# EAGLE design SCHW (EAGLE 9.2.0)

## Sheet 1 of 2
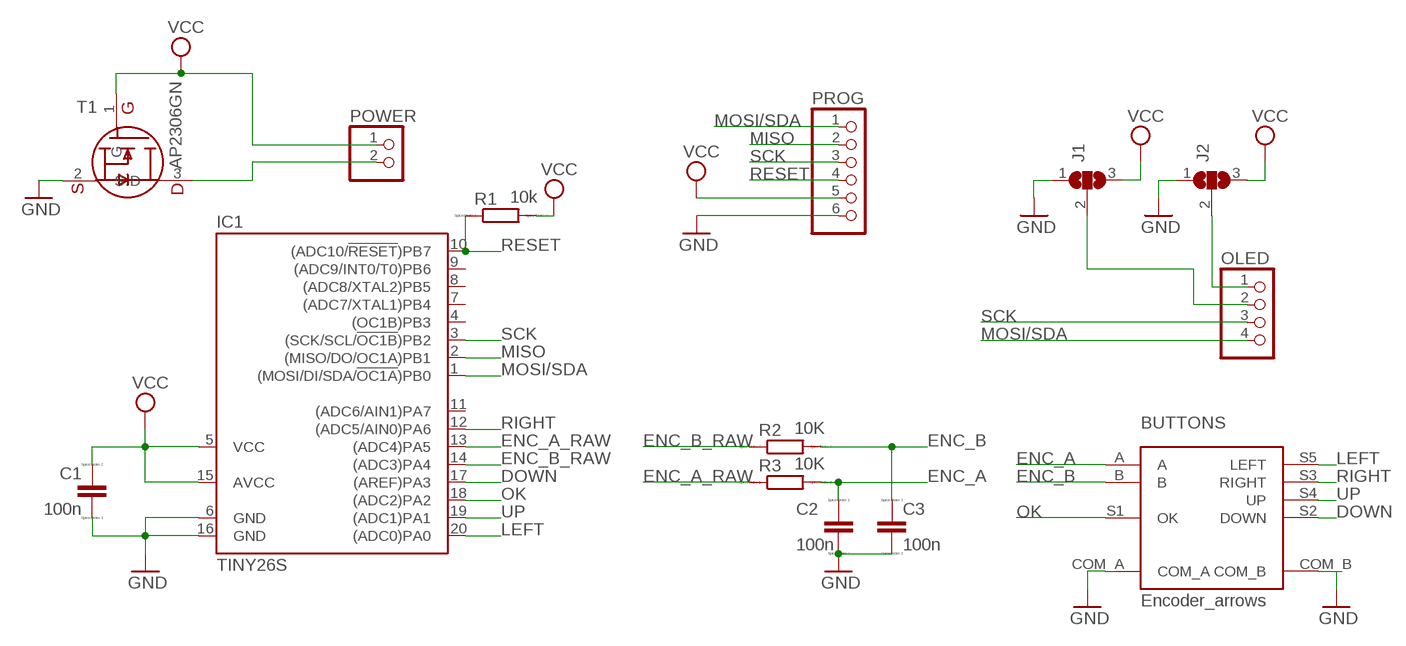
[diagram p0: schematic, sheet 1]

### Parts
BUTTONS  ENCODER_ARROWS  [ENCODER_ARROWS]
C1  100n  C  [C0805]
C2  100n  C  [C0805]
C3  100n  C  [C0805]
IC1  TINY26S  [SO20L]
J1  SJ2W  [SJ_2]
J2  SJ2W  [SJ_2]
OLED  PINHD-1X4  [1X04]
POWER  PINHD-1X2  [1X02]
PROG  PINHD-1X6  [1X06]
R1  10k  R  [R0805]
R2  10K  R  [R0805]
R3  10K  R  [R0805]
T1  AP2306GN_MOSFETSOT23  [SOT23]

### Nets
DOWN: BUTTONS.S2(DOWN) IC1.17((AREF)PA3)
ENC_A: BUTTONS.A C2.1 R3.2
ENC_A_RAW: IC1.13((ADC4)PA5) R3.1
ENC_B: BUTTONS.B C3.1 R2.2
ENC_B_RAW: IC1.14((ADC3)PA4) R2.1
GND: BUTTONS.COM_A BUTTONS.COM_B C1.1 C2.2 C3.2 IC1.6(GND) IC1.16(GND) J1.1 J2.1 PROG.6 T1.2(S)
LEFT: BUTTONS.S5(LEFT) IC1.20((ADC0)PA0)
MISO: IC1.2((MISO/DO/OC1A)PB1) PROG.2
MOSI/SDA: IC1.1((MOSI/DI/SDA/!OC1A!)PB0) OLED.4 PROG.1
N$2: POWER.2 T1.3(D)
N$3: J2.2 OLED.1
N$4: J1.2 OLED.2
OK: BUTTONS.S1(OK) IC1.18((ADC2)PA2)
RESET: IC1.10((ADC10/!RESET!)PB7) PROG.4 R1.1
RIGHT: BUTTONS.S3(RIGHT) IC1.12((ADC5/AIN0)PA6)
SCK: IC1.3((SCK/SCL/!OC1B!)PB2) OLED.3 PROG.3
UP: BUTTONS.S4(UP) IC1.19((ADC1)PA1)
VCC: C1.2 IC1.5(VCC) IC1.15(AVCC) J1.3 J2.3 POWER.1 PROG.5 R1.2 T1.1(G)
Unconnected: IC1.4((OC1B)PB3) IC1.7((ADC7/XTAL1)PB4) IC1.8((ADC8/XTAL2)PB5) IC1.9((ADC9/INT0/T0)PB6) IC1.11((ADC6/AIN1)PA7)

## Sheet 2 of 2

## Library data of the parts
BUTTONS = dt:ENCODER_ARROWS: Rottary encoder with center button and four arrows.
C1-C3 = eagle-ltspice:C: CAPACITOR, European symbol; SPICEMODEL: NONE; SPICEPREFIX: C
IC1 = atmel:TINY26*: 8-bit AVR Microcontroller with 2K Bytes Flash Source: http://www.atmel.com .. doc1477.pdf; MPN: ATTINY261-20SU; OC_FARNELL: 1455147; OC_NEWARK: 58M3783
J1 J2 = jumper:SJ2W: SMD solder JUMPER
OLED = pinhead:PINHD-1X4: PIN HEADER
POWER = pinhead:PINHD-1X2: PIN HEADER
PROG = pinhead:PINHD-1X6: PIN HEADER
R1-R3 = eagle-ltspice:R: RESISTOR, European symbol; SPICEMODEL: NONE; SPICEPREFIX: R
T1 = dt:AP2306GN_MOSFET: AP2306GN_MOSFETSOT23

## Board
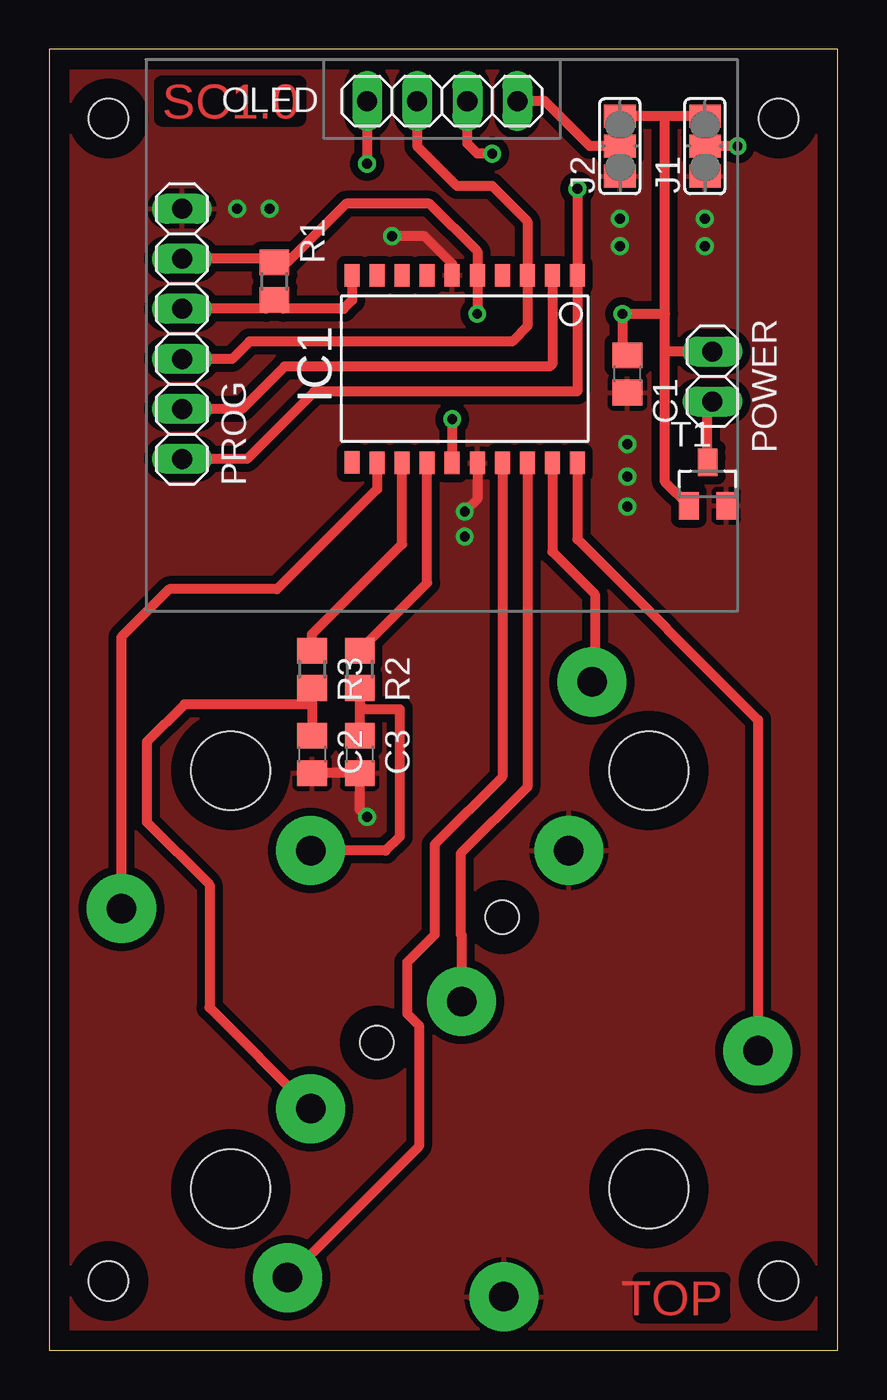
[diagram p1: board, top side]
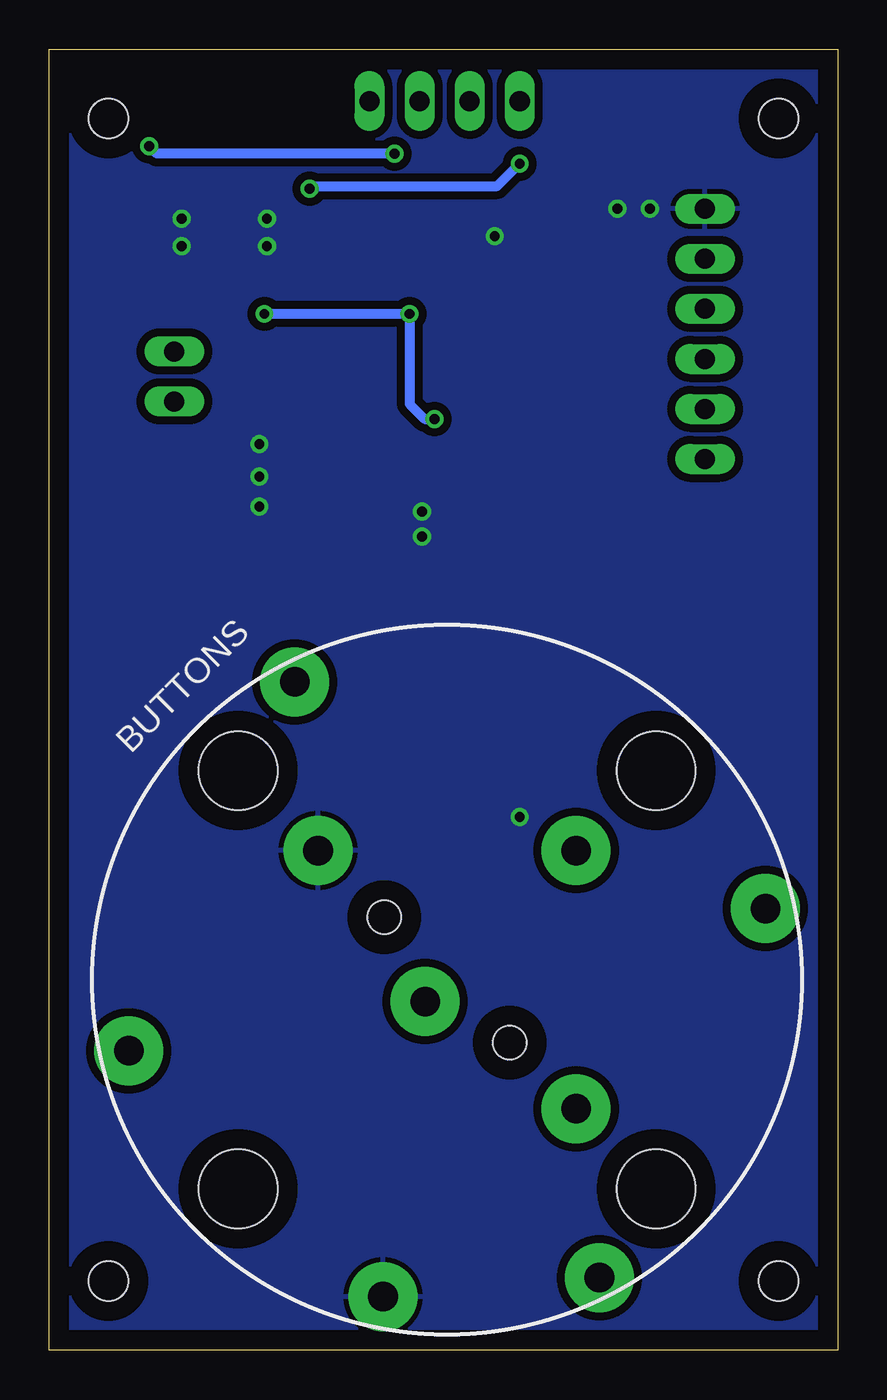
[diagram p2: board, bottom side, seen from below]

Size 40 x 66 mm. Coordinates in mm from the lower left corner, seen from the top.
Outline: 0,0 40,0 40,66 0,66 0,0
Copper layers (1*16): Top 0.035mm / dielectric 1.5mm / Bottom 0.035mm
Design rules "default": minimum track width 6mil, minimum drill 0.35mm, track to track 6mil, track to pad 6mil, pad to pad 6mil, via to via 6mil, smd to smd 6mil, copper to edge 40mil, drill to drill 6mil, minimum pad ring 10mil, minimum via ring 8mil, stop-mask expansion 4mil, vias tented up to drill 0mil, thermal gap 10mil
Holes 2 mm at 37,3.5 3,3.5 3,62.5 37,62.5

### Footprints (pad centres in the part's own frame; a part is rotated, then mirrored left to right if it is on the bottom)
ENCODER_ARROWS = drill 1.5 pad 3.5: A 0,-9.26; B 9.26,0; COM_A 0,9.26; COM_B -13.67,-9.07; S1 -1.57,0; S2 -5.22,-16.15; S3 13.97,-8.87; S4 5.22,16.15; S5 -13.97,8.87 | hole 4: 0,-15; 0,15; -15,0; 15,0 | hole 1.7: 0,4.5; 0,-4.5
C0805 = smd 1.3 x 1.5: 1 -0.95,0; 2 0.95,0
SO20L = smd 0.762 x 1.143: 1 -5.08,-5.131; 2 -3.81,-5.131; 3 -2.54,-5.131; 4 -1.27,-5.131; 5 0,-5.131; 6 1.27,-5.131; 7 2.54,-5.131; 8 3.81,-5.131; 9 5.08,-5.131; 10 6.35,-5.131; 11 6.35,4.369; 12 5.08,4.394; 13 3.81,4.394; 14 2.54,4.394; 15 1.27,4.394; 16 0,4.394; 17 -1.27,4.394; 18 -2.54,4.394; 19 -3.81,4.394; 20 -5.08,4.394
SJ_2 = smd 1.168 x 1.6: 1 -1.524,0; 2 0,0; 3 1.524,0
1X04 = drill 1.016 long: 1 -3.81,0; 2 -1.27,0; 3 1.27,0; 4 3.81,0
1X02 = drill 1.016 long: 1 -1.27,0; 2 1.27,0
1X06 = drill 1.016 long: 1 -6.35,0; 2 -3.81,0; 3 -1.27,0; 4 1.27,0; 5 3.81,0; 6 6.35,0
R0805 = smd 1.3 x 1.5: 1 -0.95,0; 2 0.95,0
SOT23 = smd 1 x 1.4: 1 -0.95,-1.1; 2 0.95,-1.1; 3 0,1.1

### Placement (x,y rotation side)
BUTTONS  19.81,18.8 45 bottom
C1  29.34,49.53 90 top
C2  13.34,30.23 270 top
C3  15.75,30.23 270 top
IC1  21.72,49.4 180 top
J1  33.27,61.09 90 top
J2  28.96,61.09 90 top
OLED  19.94,63.37 180 top
POWER  33.66,49.4 270 top
PROG  6.73,51.56 90 top
R1  11.43,54.23 90 top
R2  15.75,34.54 270 top
R3  13.34,34.54 270 top
T1  33.4,43.94 0 top

### Tracks (layer width: path | path; a pad name or v marks a point on that pad's centre or on a via)
DOWN
  Top 0.508: BUTTONS.S2 18.75,10.35 18.75,16.49 18.16,17.08 18.16,19.68 19.56,21.08 19.56,25.65 22.99,29.08 IC1.17
ENC_A
  Top 0.508: R3.2 13.34,32.77 | 13.34,32.77 C2.1 | BUTTONS.A 8.13,17.38 8.13,23.62 4.95,26.8 4.95,30.86 6.86,32.77 13.34,32.77
ENC_A_RAW
  Top 0.508: 13.46,35.62 R3.1 13.34,36.32 17.91,40.89 IC1.13 17.84,44.94
ENC_B
  Top 0.508: R2.2 15.75,32.77 | 15.75,32.77 C3.1 | BUTTONS.B 17.07,25.34 17.78,26.05 17.78,32.51 16,32.51 15.75,32.77
ENC_B_RAW
  Top 0.508: 19.05,44.88 IC1.14 19.18,38.92 R2.1
GND  (via drill 0.5)
  Top 0.508: C2.2 C3.2 15.75,27.43 v16.13,27.05 | IC1.6 20.45,55.12 19.05,56.52 v17.4,56.52 | IC1.16 21.72,43.18 v21.08,42.55
  other vias: 28.96,57.4 9.53,57.91 11.18,57.91 28.96,56.01 33.27,57.4 33.27,56.01 29.34,45.97 29.34,42.8 29.34,44.32 21.08,41.27
  pour Top (isolate 0.406): 0.38,0.38 0.38,65.53 0.51,65.53 39.62,65.53 40,65 40,0
  pour Bottom (isolate 0.406): 0.25,0.25 0.25,65.66 39.62,65.66 39.62,0.25
LEFT
  Top 0.508: IC1.20 26.8,41.15 35.96,31.98 BUTTONS.S5
MISO
  Top 0.508: PROG.2 9.78,47.75 11.94,49.91 25.4,49.91 25.53,50.04 IC1.2
MOSI/SDA  (via drill 0.5)
  Top 0.508: PROG.1 10.03,45.21 13.46,48.64 26.8,48.64 IC1.1 v26.8,58.93 | OLED.4 v16.13,60.2
  Bottom 0.508: v16.13,60.2 17.27,59.05 26.67,59.05 v26.8,58.93
N$2
  Top 0.508: 33.66,45.3 T1.3 33.4,47.88 POWER.2
N$3
  Top 0.508: J2.2 27.43,61.09 25.15,63.37 OLED.1
N$4  (via drill 0.5)
  Top 0.508: v22.48,60.71 21.72,60.71 21.21,61.21 OLED.2 | v34.92,61.09 J1.2
  Bottom 0.508: v22.48,60.71 34.54,60.71 v34.92,61.09
OK
  Top 0.508: IC1.18 24.26,28.57 20.87,25.19 20.87,21.1 20.92,21.05 BUTTONS.S1
RESET
  Top 0.508: R1.1 11.11,52.96 | R1.1 10.98,52.83 PROG.4 | R1.1 11.88,52.83 14.94,52.83 15.37,53.26 IC1.10
RIGHT
  Top 0.508: IC1.12 16.64,43.69 11.56,38.61 6.1,38.61 3.66,36.17 BUTTONS.S3
SCK
  Top 0.508: PROG.3 9.27,50.29 10.16,51.18 23.5,51.18 24.26,51.94 IC1.3 24.26,57.28 22.48,59.05 20.7,59.05 18.67,61.09 18.67,63.12 18.8,63.25 OLED.3
UP
  Top 0.508: IC1.19 25.53,40.51 27.69,38.35 27.69,34.05 BUTTONS.S4
VCC  (via drill 0.5)
  Top 0.508: PROG.5 11.24,55.37 R1.2 12.06,55.18 15.05,58.17 19.3,58.17 21.72,55.75 IC1.5 v21.72,52.58 | J1.3 31.24,62.61 | 31.24,62.61 J2.3 | v20.45,47.24 IC1.15 | C1.2 29.08,50.73 v29.08,52.58 31.24,52.58 | 32.45,42.86 T1.1 31.24,44.05 31.24,50.55 | 31.24,50.55 31.24,52.58 | 31.24,52.58 31.24,62.61 | POWER.1 31.37,50.67 31.24,50.55
  Bottom 0.508: v20.45,47.24 20.95,47.24 21.72,48.01 v21.72,52.58 v29.08,52.58

### Text on the board
Top: SC1.0 | TOP